# Altium schematic sheet 11_SCREEN.SchDoc: =TitleParameter
size A3; Organization: ASISGUARD; Address1: Kemalpasa, Kemalpasa Cd. No:290 D:292H, 35060 Bornova/Izmir/Turkey; SheetNumber: 12; SheetTotal: 12
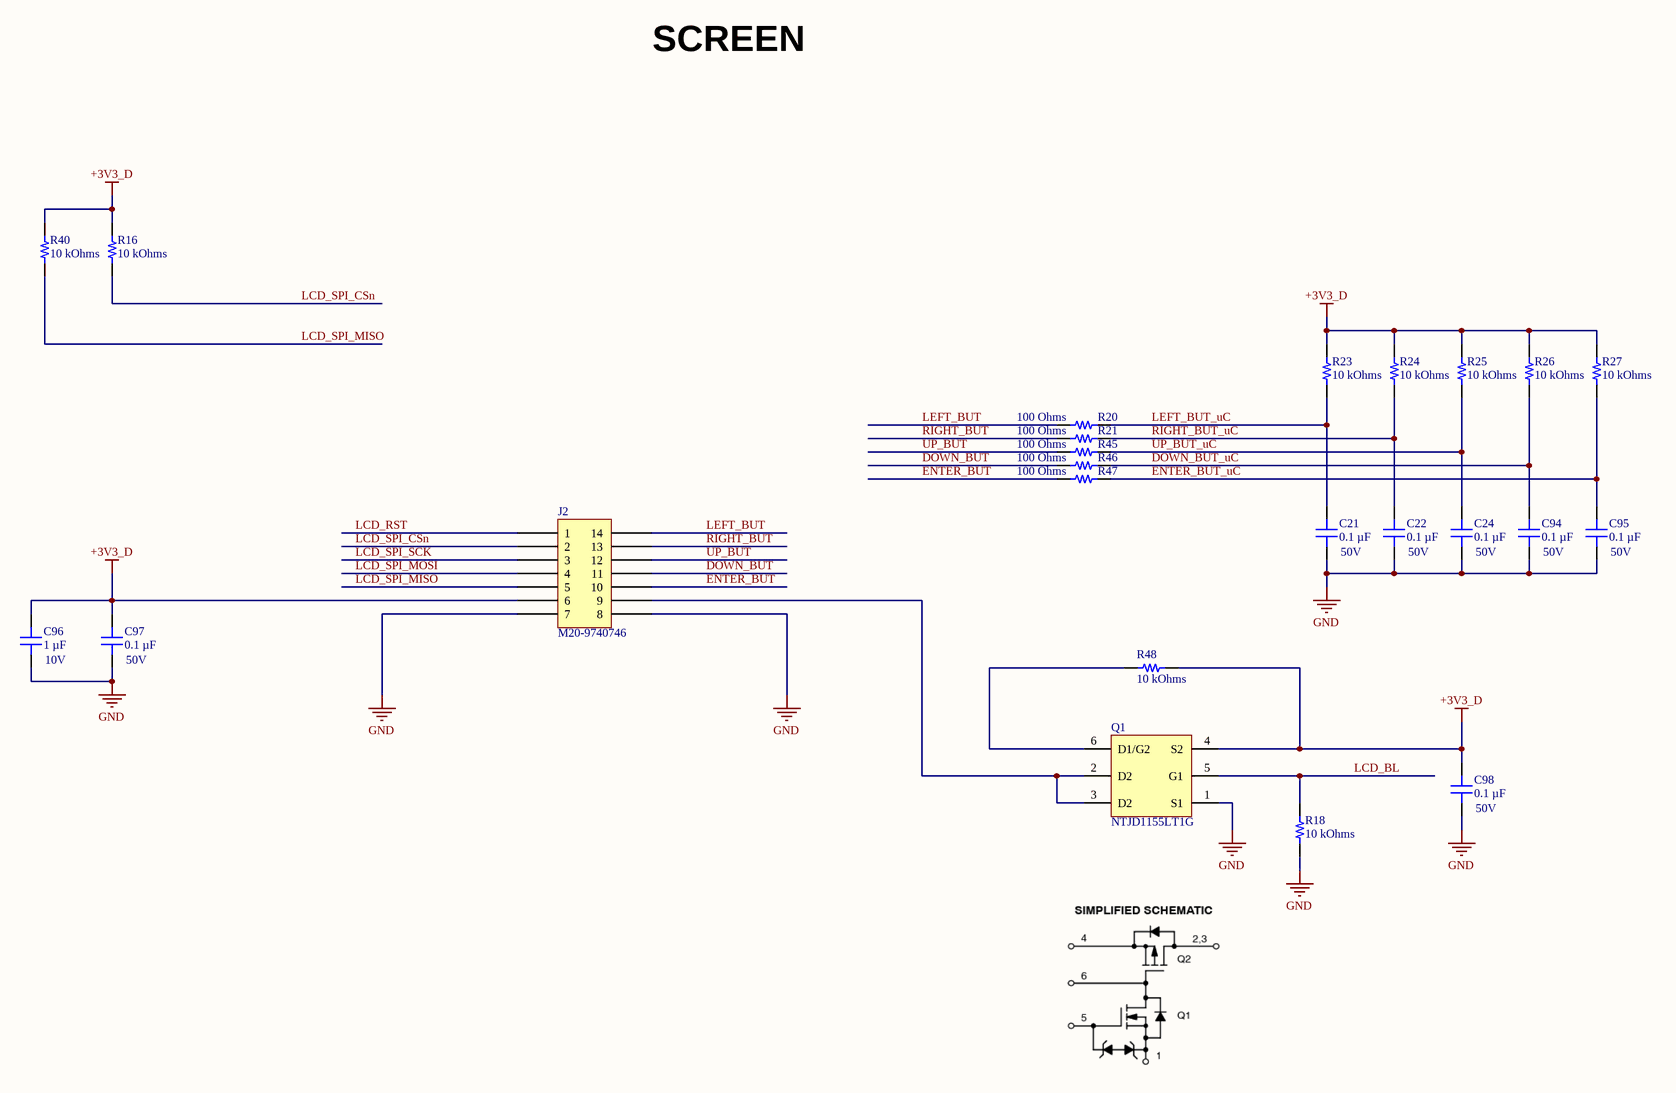
[diagram p0: 11_SCREEN.SchDoc]

## Parts
C21  Voltage - Rated: 50V  [CAP 0402_1005]  (hidden comment: 0.1 µF)
C22  Voltage - Rated: 50V  [CAP 0402_1005]  (hidden comment: 0.1 µF)
C24  Voltage - Rated: 50V  [CAP 0402_1005]  (hidden comment: 0.1 µF)
C94  Voltage - Rated: 50V  [CAP 0402_1005]  (hidden comment: 0.1 µF)
C95  Voltage - Rated: 50V  [CAP 0402_1005]  (hidden comment: 0.1 µF)
C96  Voltage - Rated: 10V  [CAP 0402_1005]  (hidden comment: 1 µF)
C97  Voltage - Rated: 50V  [CAP 0402_1005]  (hidden comment: 0.1 µF)
C98  Voltage - Rated: 50V  [CAP 0402_1005]  (hidden comment: 0.1 µF)
J2  M20-9740746  [HARWIN M20-9740745]
Q1  NTJD1155LT1G  [ONSC-SC70-6-419B-02_W_V]
R16  10 kOhms  [RES 0402_1005]
R18  10 kOhms  [RES 0402_1005]
R20  100 Ohms  [RES 0402_1005]
R21  100 Ohms  [RES 0402_1005]
R23  10 kOhms  [RES 0402_1005]
R24  10 kOhms  [RES 0402_1005]
R25  10 kOhms  [RES 0402_1005]
R26  10 kOhms  [RES 0402_1005]
R27  10 kOhms  [RES 0402_1005]
R40  10 kOhms  [RES 0402_1005]
R45  100 Ohms  [RES 0402_1005]
R46  100 Ohms  [RES 0402_1005]
R47  100 Ohms  [RES 0402_1005]
R48  10 kOhms  [RES 0402_1005]

## Nets
+3V3_D: C96.1 C97.2 C98.2 J2.6 Q1.4(S2) R16.2 R23.2 R24.2 R25.2 R26.2 R27.2 R40.2 R48.1
GND: C21.1 C22.1 C24.1 C94.1 C95.1 C96.2 C97.1 C98.1 J2.7 J2.8 Q1.1(S1) R18.1
DOWN_BUT: J2.11 R46.1
DOWN_BUT_uC: C94.2 R26.1 R46.2
ENTER_BUT: J2.10 R47.1
ENTER_BUT_uC: C95.2 R27.1 R47.2
LCD_BL: Q1.5(G1) R18.2
LCD_RST: J2.1
LCD_SPI_CSn: J2.2 R16.1
LCD_SPI_MISO: J2.5 R40.1
LCD_SPI_MOSI: J2.4
LCD_SPI_SCK: J2.3
LEFT_BUT: J2.14 R20.1
LEFT_BUT_uC: C21.2 R20.2 R23.1
RIGHT_BUT: J2.13 R21.1
RIGHT_BUT_uC: C22.2 R21.2 R24.1
UP_BUT: J2.12 R45.1
UP_BUT_uC: C24.2 R25.1 R45.2
NetJ2_9: J2.9 Q1.2(D2) Q1.3(D2)
NetQ1_6: Q1.6(D1/G2) R48.2

## Notes on the sheet
- SCREEN
- Proje/Project:
- Sayfa Adı/Document Name:
- Çizilme Tarihi/Drawing Date
- E. CAGLAV
- Tasarlayan/Designed By
- Sayfa/Sheet:
- Revision:
- of
- Son Güncelleme/Last Edit Date
- Kontrol eden/Checked By
- Onaylayan/Approved By
- Boyut/Size:
- Varyant/Variant:
- Dil/Language:
- A3
- ENG

## Library data of the parts
C21 C22 C24 C94 C95 C97 C98 = GCM155R71H104KE02J: CAP CER 0.1UF 50V X7R 0402; manufacturer: Murata Electronics; Tolerance: ±10%; Part Number: GCM155R71H104KE02J; Capacitance: 0.1 µF; Applications: Automotive; componentlink1description: Datasheet; componentlink1url: https://search.murata.co.jp/Ceramy/image/img/A01X/G101/ENG/GCM155R71H104KE02-01.pdf; componentlink2description: DigiKey Link; componentlink2url: https://www.digikey.com/en/products/detail/murata-electronics/GCM155R71H104KE02J/4903705; Device Package: 0402 (1005 Metric); lastupdated: 4/6/2026 7:10:30 PM; Lifecycle Status: Active; Minimum Order: 1; Mounting Type: Surface Mount, MLCC; Operating Temperature: -55°C ~ 125°C; Package / Case: 0402 (1005 Metric); packaging: TapeAndReel; partid: 11356; Part Status: Active; price: 0.01; Ratings: AEC-Q200; series: GCM; Size / Dimension: 0.039" L x 0.020" W (1.00mm x 0.50mm); Supplier 1: DigiKey; Supplier Part Number 1: 490-14514-1-ND; Temperature Coefficient: X7R; Thickness (Max): 0.022" (0.55mm); value: 0.1 µF
C96 = GRM155C71A105KE11D: CAP CER 1UF 10V X7S 0402; manufacturer: Murata Electronics; Tolerance: ±10%; Part Number: GRM155C71A105KE11D; Capacitance: 1 µF; Applications: General Purpose; componentlink1description: Datasheet; componentlink1url: https://search.murata.co.jp/Ceramy/image/img/A01X/G101/ENG/GRM155C71A105KE11-01.pdf; componentlink2description: DigiKey Link; componentlink2url: https://www.digikey.com/en/products/detail/murata-electronics/GRM155C71A105KE11D/6606086; Device Package: 0402 (1005 Metric); lastupdated: 4/6/2026 7:11:12 PM; Lifecycle Status: Active; Minimum Order: 1; Mounting Type: Surface Mount, MLCC; Operating Temperature: -55°C ~ 125°C; Package / Case: 0402 (1005 Metric); packaging: TapeAndReel; partid: 1749; Part Status: Active; price: 0.01; series: GRM; Size / Dimension: 0.039" L x 0.020" W (1.00mm x 0.50mm); Supplier 1: DigiKey; Supplier Part Number 1: 490-14457-1-ND; Temperature Coefficient: X7S; Thickness (Max): 0.024" (0.60mm); value: 1 µF
J2 = M20-9740746: CONN HEADER R/A 14POS 2.54MM; Manufacturer: Harwin Inc.; Connector Type: Header, Cuttable; Current Rating (Amps): 3A per Contact; Material Flammability Rating: UL94 V-0; Number of Positions: 14; Number of Positions Loaded: All; Shrouding: Unshrouded; Style: Board to Board or Cable; Part Number: M20-9740746; ComponentLink1Description: Datasheet; ComponentLink1URL: https://cdn.harwin.com/pdfs/M20-974.pdf; ComponentLink2Description: DigiKey Link; ComponentLink2URL: http://digikey.com/product-detail/en/harwin-inc/M20-9740746/M20-9740746-ND/3920721; Contact Finish - Mating: Tin; Contact Finish - Post: Tin; Contact Material: Brass; Contact Shape: Square; Contact Type: Male Pin; Fastening Type: Push-Pull; Insulation Color: Black; Insulation Material: Polyamide (PA6T), Nylon 6T; LastUpdated: 9/21/2022 7:19:11 PM; Lifecycle Status: Active; Minimum Order: 1500; Mounting Type: Through Hole, Right Angle; Number of Rows: 2; Operating Temperature: -40°C ~ 105°C; Packaging: Bulk; PartId: 160; Part Status: Active; Price: 0.24; Series: M20; Supplier 1: DigiKey; Supplier Part Number 1: M20-9740746-ND; Termination: Solder
Q1 = CMP-1058-00640-1: Power MOSFET, 8 V, +/- 1.3 A, High Side Load Switch with Level-Shift, P-Channel, 6-Pin SC70, Pb-Free, Tape and Reel; Manufacturer: On Semiconductor; V(BR)DSS Min (V): 8; VGS(th) Max (V): 1; ID Max (A): 1.3; Channel Polarity: P Channel; Configuration: Dual; ComponentLink1Description: Manufacturer URL; ComponentLink3Description: Package Specification; PackageVersion: Rev. W; Packing: Tape and Reel; PackageReference: SC70-6-419B-02_W; ComponentLink3URL: http://www.onsemi.com/pub_link/Collateral/SMF05C-D.PDF; ComponentLink1URL: http://www.onsemi.com/; PackageDescription: 6-Pin Small Outline Transistor, Body 2 x 1.25 mm, Pitch 0.65 mm; DatasheetVersion: Rev. 5; RoHS: Pb-Free; ComponentLink2Description: Datasheet; ComponentLink2URL: http://www.onsemi.com/pub_link/Collateral/NTJD1155L-D.PDF; PartNumber: NTJD1155LT1G; Package Type: SC-88-6 / SC-70-6 / SOT-363-6; Mounting Technology: Surface Mount
R16 R18 R23-R27 R40 R48 = RC0402FR-0710KL: RES 10K OHM 1% 1/16W 0402; Manufacturer: Yageo; Power (Watts): 0.063W, 1/16W; Temperature Coefficient: ±100ppm/°C; Part Number: RC0402FR-0710KL; Value: 10 kOhms; ComponentLink1Description: Datasheet; ComponentLink1URL: https://www.yageo.com/upload/media/product/productsearch/datasheet/rchip/PYu-RC_Group_51_RoHS_L_10.pdf; ComponentLink2Description: DigiKey Link; ComponentLink2URL: https://www.digikey.com/en/products/detail/yageo/RC0402FR-0710KL/726523; Composition: Thick Film; Device Package: 0402 (1005 Metric); Features: Moisture Resistant; Height - Seated (Max): 0.016" (0.40mm); LastUpdated: 4/6/2026 7:41:07 PM; Lifecycle Status: Active; Minimum Order: 1; Number of Terminations: 2; Operating Temperature: -55°C ~ 155°C; Package / Case: 0402 (1005 Metric); Packaging: CutTape; PartId: 17593; Part Status: Active; Price: 0.01; Resistance: 10 kOhms; Series: RC_L; Size / Dimension: 0.039" L x 0.020" W (1.00mm x 0.50mm); Supplier 1: DigiKey; Supplier Part Number 1: 311-10.0KLRCT-ND; Supplier Device Package: 0402; Tolerance: ±1%
R20 R21 R45-R47 = RT0402FRE07100RL: RES SMD 100 OHM 1% 1/16W 0402; Manufacturer: Yageo; Power (Watts): 0.063W, 1/16W; Temperature Coefficient: ±50ppm/°C; Part Number: RT0402FRE07100RL; Value: 100 Ohms; ComponentLink1Description: Datasheet; ComponentLink1URL: https://www.yageo.com/upload/media/product/productsearch/datasheet/rchip/PYu-RT_1-to-0.01_RoHS_L_11.pdf; ComponentLink2Description: DigiKey Link; ComponentLink2URL: https://www.digikey.com/en/products/detail/yageo/RT0402FRE07100RL/1071699; Composition: Thin Film; Device Package: 0402 (1005 Metric); Height - Seated (Max): 0.014" (0.35mm); LastUpdated: 4/6/2026 7:41:17 PM; Lifecycle Status: Active; Minimum Order: 1; Number of Terminations: 2; Operating Temperature: -55°C ~ 155°C; Package / Case: 0402 (1005 Metric); Packaging: TapeAndReel; PartId: 3193; Part Status: Active; Price: 0.01; Resistance: 100 Ohms; Series: RT; Size / Dimension: 0.039" L x 0.020" W (1.00mm x 0.50mm); Supplier 1: DigiKey; Supplier Part Number 1: YAG3342CT-ND; Supplier Device Package: 0402; Tolerance: ±1%